# Altium schematic sheet daplink_stm32f205_test.SchDoc: DAPLINK for STM32F205 test
size A4; Organization: Altium Limited; Address1: L3, 12a Rodborough Rd; Address2: Frenchs Forest; Address3: NSW; Address4: Australia 2086; DocumentNumber: 1; Revision: V1.0; SheetNumber: 1; SheetTotal: 1
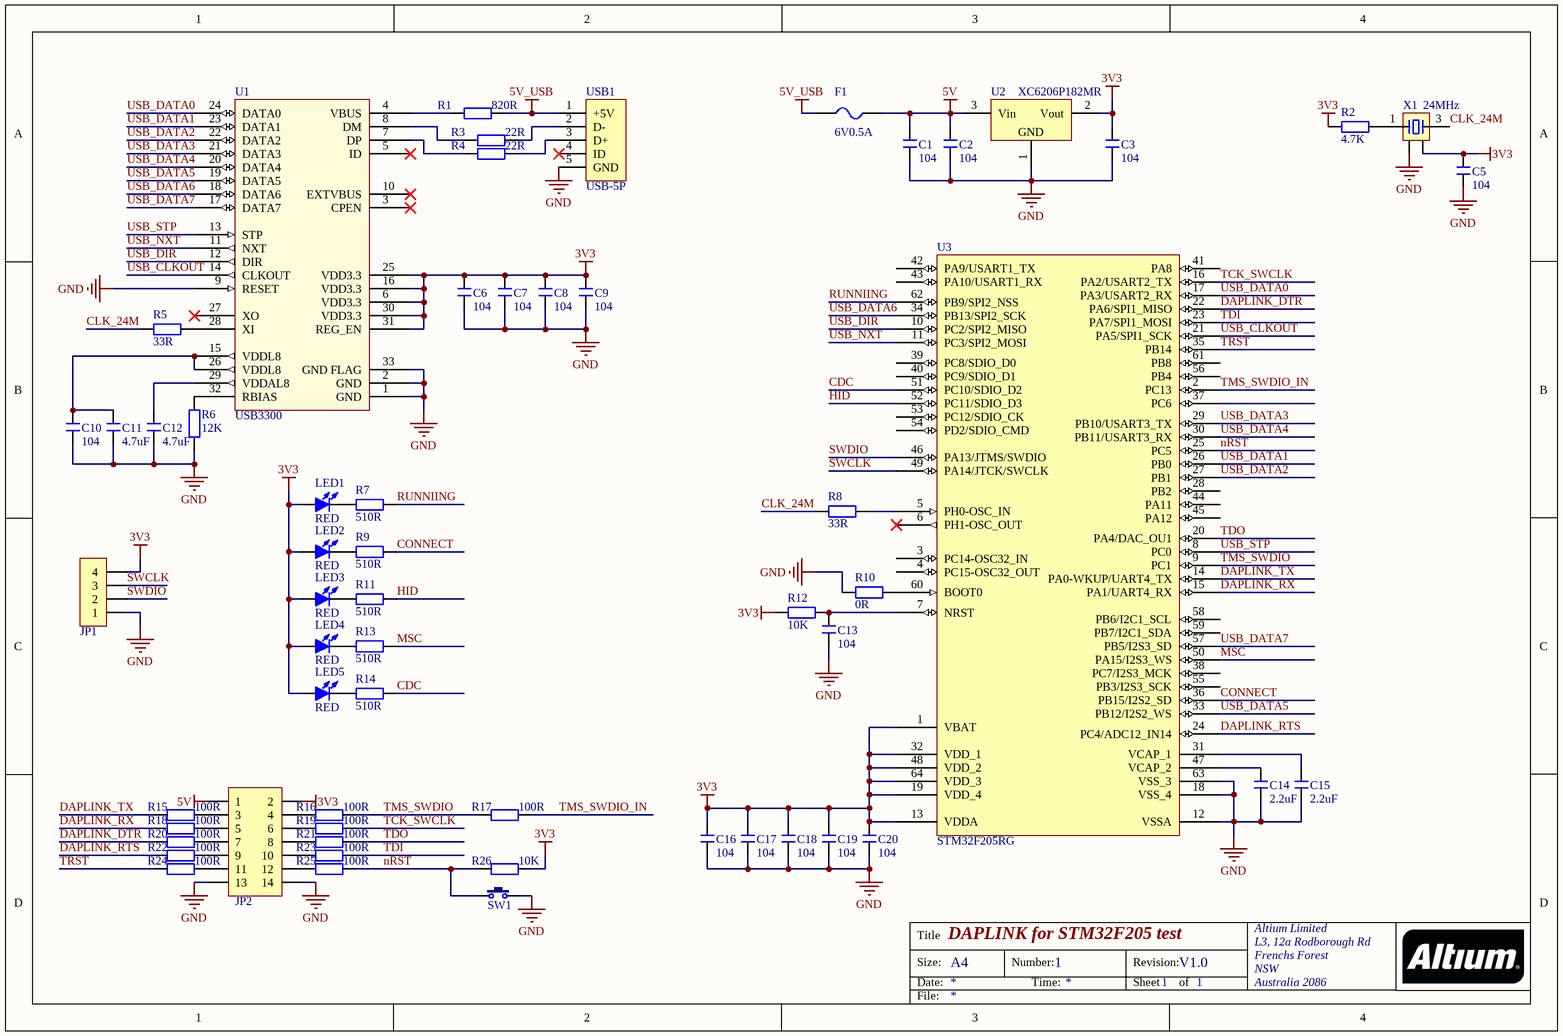
[diagram p0: daplink_stm32f205_test.SchDoc]

## Parts
C1  104  [C 0603]
C2  104  [C 0805]
C3  104  [C 0603]
C5  104  [C 0603]
C6  104  [C 0603]
C7  104  [C 0603]
C8  104  [C 0603]
C9  104  [C 0603]
C10  104  [C 0603]
C11  4.7uF  [C 0603]
C12  4.7uF  [C 0603]
C13  104  [C 0603]
C14  2.2uF  [C 0603]
C15  2.2uF  [C 0603]
C16  104  [C 0603]
C17  104  [C 0603]
C18  104  [C 0603]
C19  104  [C 0603]
C20  104  [C 0603]
F1  6V0.5A  [FU 0805]
JP1  HDR-1X4  [HDR-1X4]  (value not drawn)
JP2  Header 2X7  [HDR-7X2_H]  (value not drawn)
LED1  RED  [LED 0805B]
LED2  RED  [LED 0805B]
LED3  RED  [LED 0805B]
LED4  RED  [LED 0805B]
LED5  RED  [LED 0805B]
R1  820R  [R 0603]
R2  4.7K  [R 0603]
R3  22R  [R 0603]
R4  22R  [R 0603]
R5  33R  [R 0603]
R6  12K  [R 0603]
R7  510R  [R 0603]
R8  33R  [R 0603]
R9  510R  [R 0603]
R10  0R  [R 0603]
R11  510R  [R 0603]
R12  10K  [R 0603]
R13  510R  [R 0603]
R14  510R  [R 0603]
R15  100R  [R 0603]
R16  100R  [R 0603]
R17  100R  [R 0603]
R18  100R  [R 0603]
R19  100R  [R 0603]
R20  100R  [R 0603]
R21  100R  [R 0603]
R22  100R  [R 0603]
R23  100R  [R 0603]
R24  100R  [R 0603]
R25  100R  [R 0603]
R26  10K  [R 0603]
SW1  3x6x5  [TSW 3*6*4.3-S-W]  (value not drawn)
U1  USB3300  [QFN32 5x5_N]
U2  XC6206P182MR  [SOT23-3N]
U3  STM32F205RG  [LQFP64 10X10_N]
USB1  USB-5P  [micro usb]
X1  24MHz  [XTAL-5032]

## Nets
3V3: C3.2 C5.2 C6.2 C7.2 C8.2 C9.2 C16.2 C17.2 C18.2 C19.2 C20.2 JP1.4 JP2.2 LED1.1(A) LED2.1(A) LED3.1(A) LED4.1(A) LED5.1(A) R2.1 R12.1 R26.2 U1.6(VDD3.3) U1.16(VDD3.3) U1.25(VDD3.3) U1.30(VDD3.3) U1.31(REG_EN) U2.2(Vout) U3.1(VBAT) U3.13(VDDA) U3.19(VDD_4) U3.32(VDD_1) U3.48(VDD_2) U3.64(VDD_3) X1.4
5V: C1.2 C2.2 F1.2 JP2.1 U2.3(Vin)
5V_USB: F1.1 R1.2 USB1.1(+5V)
GND: C1.1 C2.1 C3.1 C5.1 C6.1 C7.1 C8.1 C9.1 C10.1 C11.1 C12.1 C13.1 C14.1 C15.1 C16.1 C17.1 C18.1 C19.1 C20.1 JP1.1 JP2.13 JP2.14 R6.1 R10.1 SW1.2 U1.1(GND) U1.2(GND) U1.9(RESET) U1.33(GND_FLAG) U2.1(GND) U3.12(VSSA) U3.18(VSS_4) U3.63(VSS_3) USB1.5(GND) X1.2
CDC: R14.1 U3.51(PC10/SDIO_D2)
CLK_24M: R5.1 R8.1 X1.3
CONNECT: R9.1 U3.36(PB15/I2S2_SD)
DAPLINK_DTR: R20.1 U3.22(PA6/SPI1_MISO)
DAPLINK_RTS: R22.1 U3.24(PC4/ADC12_IN14)
DAPLINK_RX: R18.1 U3.15(PA1/UART4_RX)
DAPLINK_TX: R15.1 U3.14(PA0-WKUP/UART4_TX)
HID: R11.1 U3.52(PC11/SDIO_D3)
MSC: R13.1 U3.50(PA15/I2S3_WS)
nRST: R25.2 R26.1 SW1.1 U3.25(PC5)
RUNNIING: R7.1 U3.62(PB9/SPI2_NSS)
SWCLK: JP1.3 U3.49(PA14/JTCK/SWCLK)
SWDIO: JP1.2 U3.46(PA13/JTMS/SWDIO)
TCK_SWCLK: R19.2 U3.16(PA2/USART2_TX)
TDI: R23.2 U3.23(PA7/SPI1_MOSI)
TDO: R21.2 U3.20(PA4/DAC_OU1)
TMS_SWDIO: R16.2 R17.1 U3.9(PC1)
TMS_SWDIO_IN: R17.2 U3.2(PC13)
TRST: R24.1 U3.35(PB14)
USB_CLKOUT: U1.14(CLKOUT) U3.21(PA5/SPI1_SCK)
USB_DATA0: U1.24(DATA0) U3.17(PA3/USART2_RX)
USB_DATA1: U1.23(DATA1) U3.26(PB0)
USB_DATA2: U1.22(DATA2) U3.27(PB1)
USB_DATA3: U1.21(DATA3) U3.29(PB10/USART3_TX)
USB_DATA4: U1.20(DATA4) U3.30(PB11/USART3_RX)
USB_DATA5: U1.19(DATA5) U3.33(PB12/I2S2_WS)
USB_DATA6: U1.18(DATA6) U3.34(PB13/SPI2_SCK)
USB_DATA7: U1.17(DATA7) U3.57(PB5/I2S3_SD)
USB_DIR: U1.12(DIR) U3.10(PC2/SPI2_MISO)
USB_NXT: U1.11(NXT) U3.11(PC3/SPI2_MOSI)
USB_STP: U1.13(STP) U3.8(PC0)
NetC10_2: C10.2 C11.2 U1.15(VDDL8) U1.26(VDDL8)
NetC12_2: C12.2 U1.29(VDDAL8)
NetC13_2: C13.2 R12.2 U3.7(NRST)
NetC14_2: C14.2 U3.47(VCAP_2)
NetC15_2: C15.2 U3.31(VCAP_1)
NetJP2_3: JP2.3 R15.2
NetJP2_4: JP2.4 R16.1
NetJP2_5: JP2.5 R18.2
NetJP2_6: JP2.6 R19.1
NetJP2_7: JP2.7 R20.2
NetJP2_8: JP2.8 R21.1
NetJP2_9: JP2.9 R22.2
NetJP2_10: JP2.10 R23.1
NetJP2_11: JP2.11 R24.2
NetJP2_12: JP2.12 R25.1
NetLED1_2: LED1.2(K) R7.2
NetLED2_2: LED2.2(K) R9.2
NetLED3_2: LED3.2(K) R11.2
NetLED4_2: LED4.2(K) R13.2
NetLED5_2: LED5.2(K) R14.2
NetR1_1: R1.1 U1.4(VBUS)
NetR2_2: R2.2 X1.1
NetR3_1: R3.1 U1.8(DM)
NetR3_2: R3.2 USB1.2(D-)
NetR4_1: R4.1 U1.7(DP)
NetR4_2: R4.2 USB1.3(D+)
NetR5_2: R5.2 U1.28(XI)
NetR6_2: R6.2 U1.32(RBIAS)
NetR8_2: R8.2 U3.5(PH0-OSC_IN)
NetR10_2: R10.2 U3.60(BOOT0)

Not connected (* = marked no-connect by the designer): U1 3(CPEN)* 5(ID)* 10(EXTVBUS)* 27(XO)*; U3 3(PC14-OSC32_IN) 4(PC15-OSC32_OUT) 6(PH1-OSC_OUT)* 28(PB2) 37(PC6) 38(PC7/I2S3_MCK) 39(PC8/SDIO_D0) 40(PC9/SDIO_D1) 41(PA8) 42(PA9/USART1_TX) 43(PA10/USART1_RX) 44(PA11) 45(PA12) 53(PC12/SDIO_CK) 54(PD2/SDIO_CMD) 55(PB3/I2S3_SCK) 56(PB4) 58(PB6/I2C1_SCL) 59(PB7/I2C1_SDA) 61(PB8); USB1 4(ID)*

## Notes on the sheet
- Title
- Size:
- Date:
- A4
- Number:
- Time:
- Revision:
- Sheet
- of
- File:

## Library data of the parts
C1-C3 C5-C20 = C: 无极性贴片电容; 版权归属: 源创客; BOM名称: 无极性贴片电容; 学习资源: www.ooocke.com
F1 = FU: 贴片保险丝; 版权归属: 源创客; BOM名称: 贴片保险丝; 学习资源: www.ooocke.com
JP1 = Header 4: 4P接插件; 版权归属: 源创客; BOM名称: 4P接插件; 学习资源: www.ooocke.com
JP2 = Header 7X2: 7*2P接插件; 版权归属: 源创客; BOM名称: 7*2P接插件; 学习资源: www.ooocke.com
LED1-LED5 = LED-SMD: 贴片LED; 版权归属: 源创客; BOM名称: 贴片LED; 学习资源: www.ooocke.com
R1-R26 = R: 贴片电阻; 版权归属: 源创客; BOM名称: 贴片电阻; 学习资源: www.ooocke.com
SW1 = TSW 3x6: 3x6轻触开关; 版权归属: 源创客; BOM名称: 3x6轻触开关; 学习资源: www.ooocke.com
U1 = USB3300: USB PHY
U2 = XC6206P182MR: 三端稳压芯片
U3 = STM32F205RG: 32位STM单片机; 版权归属: 源创客; BOM名称: 32位STM单片机; 学习资源: www.ooocke.com
USB1 = USB-5P: 微型USB母座; 版权归属: 源创客; BOM名称: 微型USB母座; 学习资源: www.ooocke.com
X1 = XTAL-4: 4脚晶振; 版权归属: 源创客; BOM名称: 4脚晶振; 学习资源: www.ooocke.com